# Altium schematic sheet Mini_STM32F405RGT6_V1.0.SchDoc
size A3
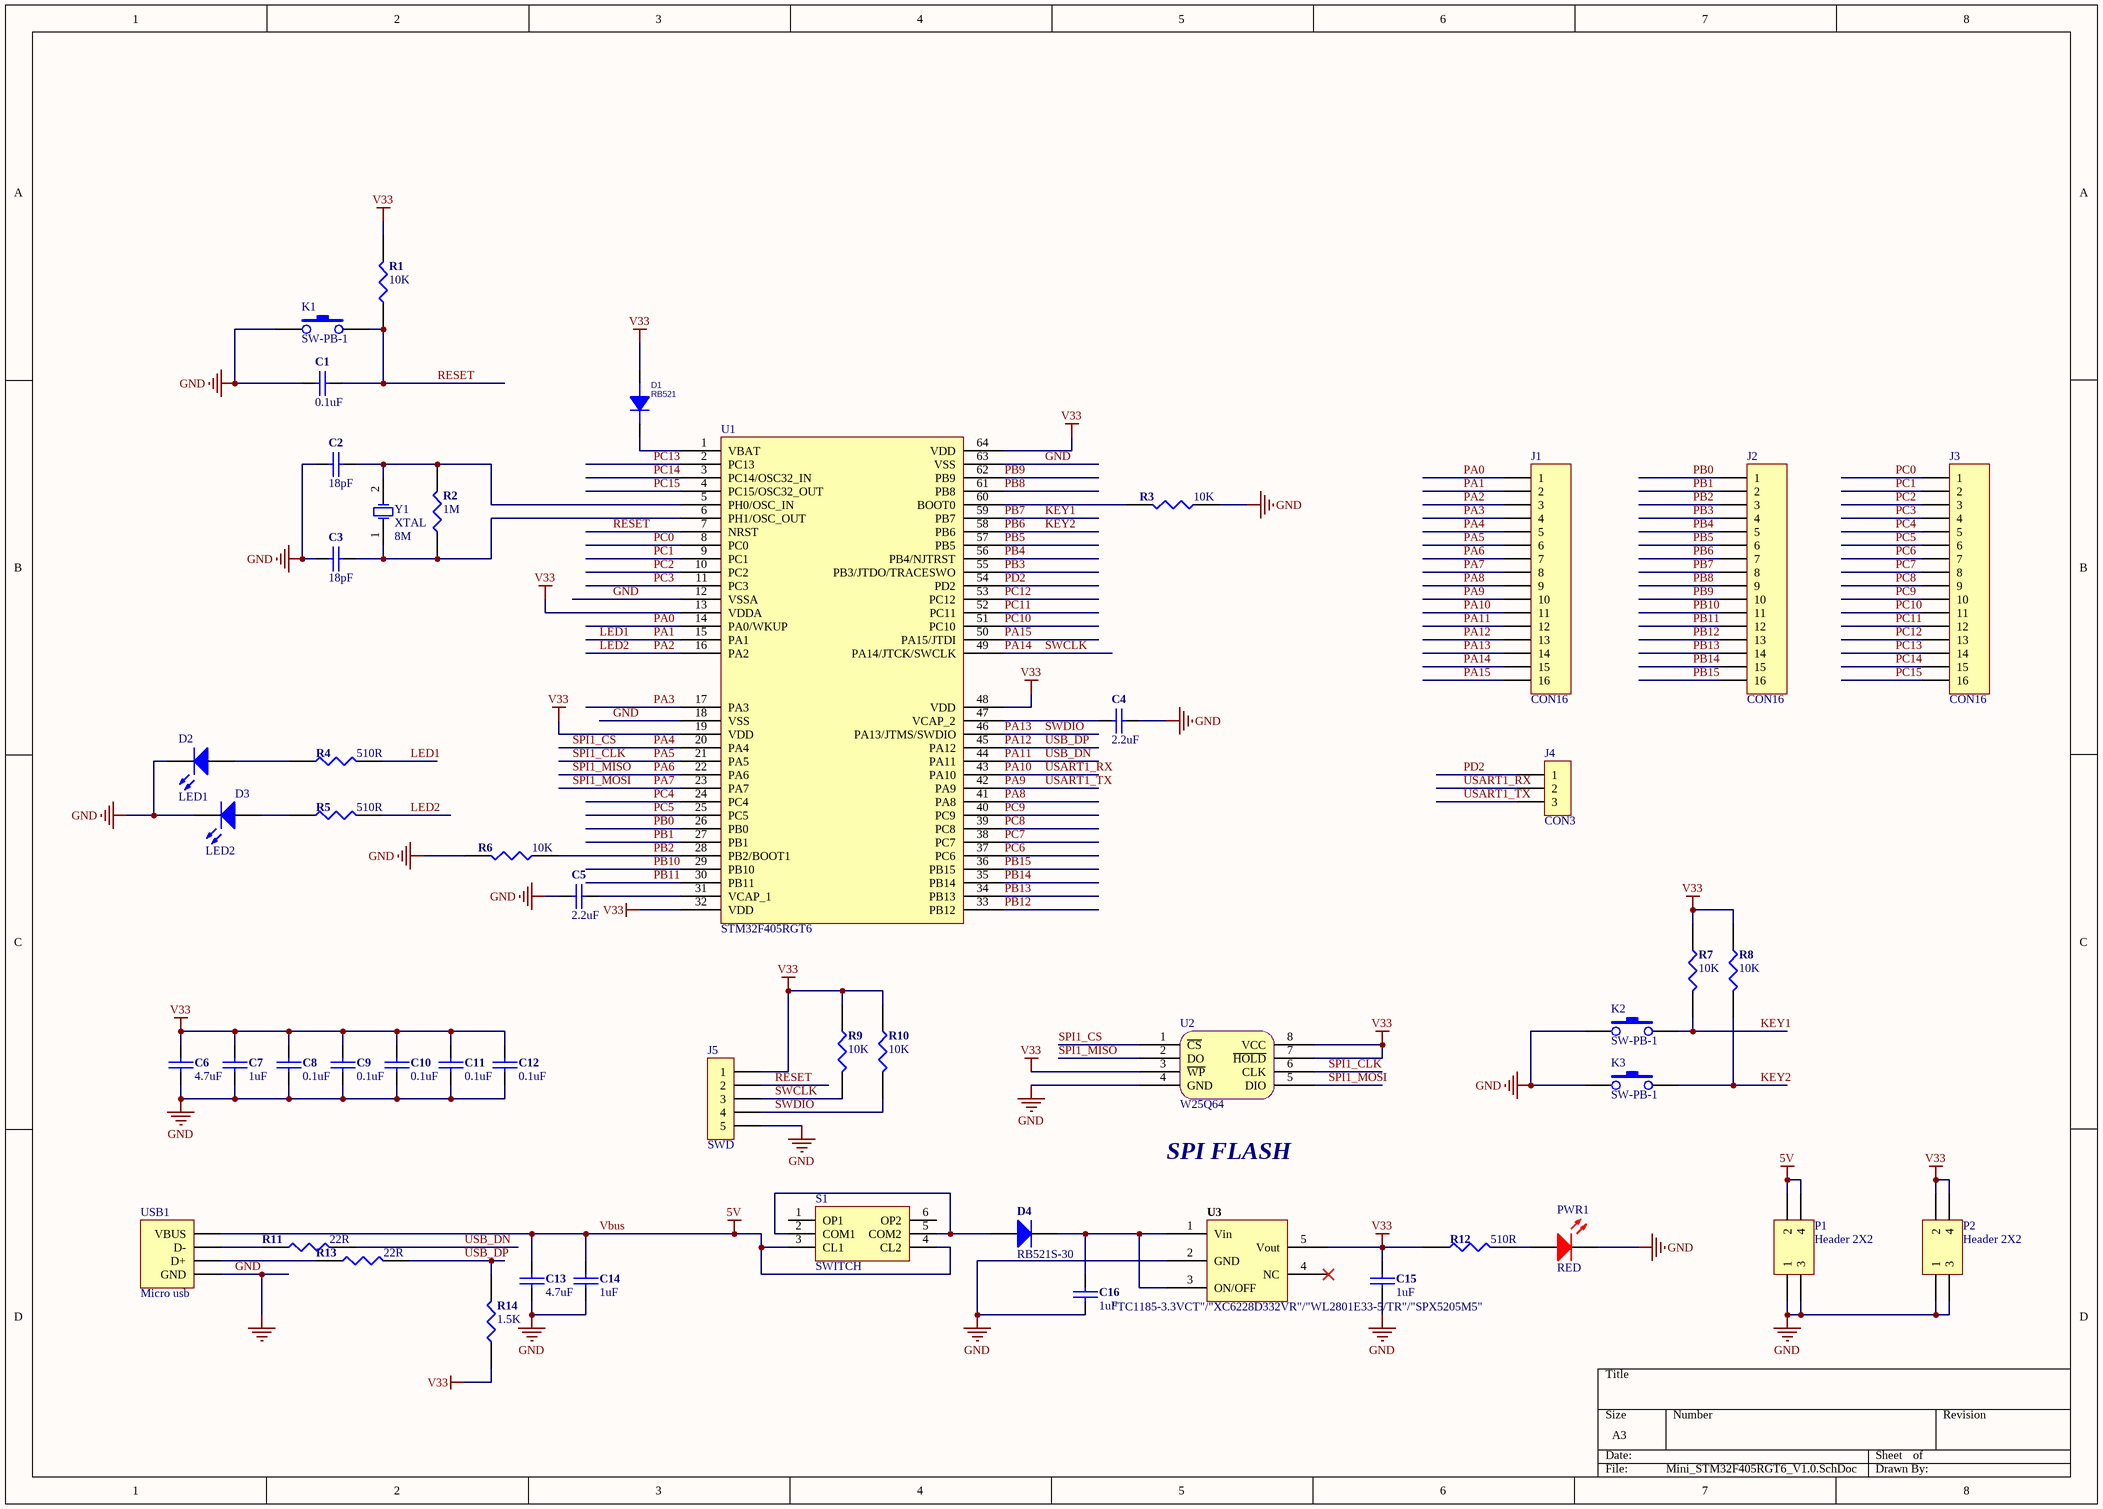
[diagram p0: Mini_STM32F405RGT6_V1.0.SchDoc]

## Parts
C1  0.1uF  [C0402]
C2  18pF  [C0402]
C3  18pF  [C0402]
C4  2.2uF  [C0402]
C5  2.2uF  [C0402]
C6  4.7uF  [C0603]
C7  1uF  [C0402]
C8  0.1uF  [C0402]
C9  0.1uF  [C0402]
C10  0.1uF  [C0402]
C11  0.1uF  [C0402]
C12  0.1uF  [C0402]
C13  4.7uF  [C0603]
C14  1uF  [C0402]
C15  1uF  [C0402]
C16  1uF  [C0402]
D1  RB521  [Diode-0603]
D2  LED1  [LED0603-green]
D3  LED2  [LED0603-green]
D4  RB521S-30  [Diode-0603]
J1  CON16  [HEADER-16]
J2  CON16  [HEADER-16]
J3  CON16  [HEADER-16]
J4  CON3  [HEADER-3]
J5  SWD  [HEADER-5]
K1  SW-PB-1  [SW-4PIN-DIP]
K2  SW-PB-1  [SW-4PIN-DIP]
K3  SW-PB-1  [SW-4PIN-DIP]
P1  Header 2X2  [HDR2X2]
P2  Header 2X2  [HDR2X2]
PWR1  RED  [LED-0805-R]
R1  10K  [R0402 -1]
R2  1M  [R0402 -1]
R3  10K  [R0402 -1]
R4  510R  [R0402 -1]
R5  510R  [R0402 -1]
R6  10K  [R0402 -1]
R7  10K  [R0402 -1]
R8  10K  [R0402 -1]
R9  10K  [R0402 -1]
R10  10K  [R0402 -1]
R11  22R  [R0402 -1]
R12  510R  [R0402 -1]
R13  22R  [R0402 -1]
R14  1.5K  [R0402 -1]
S1  SWITCH  [SWITCH_DDSZ]
U1  STM32F405RGT6  [LQFP-64]
U2  W25Q64  USAGE: SPI FLASH  [SOIC-AB]
U3  "TC1185-3.3VCT"/"XC6228D332VR"/"WL2801E33-5/TR"/"SPX5205M5"  [SOT-23-5]
USB1  Micro usb  [MICRO_USB_9]
Y1  XTAL  [XTAL]

## Nets
4: USB1.5 USB1.6
GND: C1.2 C2.2 C3.2 C4.1 C5.2 C6.1 C7.1 C8.1 C9.1 C10.1 C11.1 C12.1 C13.1 C14.1 C15.1 C16.1 D2.2(K) D3.2(K) J5.5 K1.1 K2.1 K3.1 P1.1 P1.3 P2.1 P2.3 PWR1.2(K) R3.1 R6.2 U1.12(VSSA) U1.18(VSS) U1.63(VSS) U2.4(GND) U3.2(GND) USB1.4(GND)
V33: C6.2 C7.2 C8.2 C9.2 C10.2 C11.2 C12.2 C15.2 D1.1(A) J5.1 P2.2 P2.4 R1.2 R7.1 R8.1 R9.1 R10.1 R12.1 R14.1 U1.13(VDDA) U1.19(VDD) U1.32(VDD) U1.48(VDD) U1.64(VDD) U2.3(~{WP}) U2.7(~{HOLD}) U2.8(VCC) U3.5(Vout)
Vbus: C13.2 C14.2 P1.2 P1.4 S1.3(CL1) S1.4(CL2) USB1.1(VBUS)  [also labelled 5V]
KEY1: J2.8 K2.2 R7.2 U1.59(PB7)  [also labelled PB7]
KEY2: J2.7 K3.2 R8.2 U1.58(PB6)  [also labelled PB6]
LED1: J1.2 R4.2 U1.15(PA1)  [also labelled PA1]
LED2: J1.3 R5.2 U1.16(PA2)  [also labelled PA2]
PA0: J1.1 U1.14(PA0/WKUP)
PA3: J1.4 U1.17(PA3)
PA4: J1.5 U1.20(PA4) U2.1(~{CS})  [also labelled SPI1_CS]
PA5: J1.6 U1.21(PA5) U2.6(CLK)  [also labelled SPI1_CLK]
PA6: J1.7 U1.22(PA6) U2.2(DO)  [also labelled SPI1_MISO]
PA7: J1.8 U1.23(PA7) U2.5(DIO)  [also labelled SPI1_MOSI]
PA8: J1.9 U1.41(PA8)
PA9: J1.10 J4.3 U1.42(PA9)  [also labelled USART1_TX]
PA10: J1.11 J4.2 U1.43(PA10)  [also labelled USART1_RX]
PA11: J1.12 R11.2 U1.44(PA11)  [also labelled USB_DN]
PA12: J1.13 R13.2 R14.2 U1.45(PA12)  [also labelled USB_DP]
PA13: J1.14 J5.4 R10.2 U1.46(PA13/JTMS/SWDIO)  [also labelled SWDIO]
PA14: J1.15 J5.3 R9.2 U1.49(PA14/JTCK/SWCLK)  [also labelled SWCLK]
PA15: J1.16 U1.50(PA15/JTDI)
PB0: J2.1 U1.26(PB0)
PB1: J2.2 U1.27(PB1)
PB2: J2.3 R6.1 U1.28(PB2/BOOT1)
PB3: J2.4 U1.55(PB3/JTDO/TRACESWO)
PB4: J2.5 U1.56(PB4/NJTRST)
PB5: J2.6 U1.57(PB5)
PB8: J2.9 U1.61(PB8)
PB9: J2.10 U1.62(PB9)
PB10: J2.11 U1.29(PB10)
PB11: J2.12 U1.30(PB11)
PB12: J2.13 U1.33(PB12)
PB13: J2.14 U1.34(PB13)
PB14: J2.15 U1.35(PB14)
PB15: J2.16 U1.36(PB15)
PC0: J3.1 U1.8(PC0)
PC1: J3.2 U1.9(PC1)
PC2: J3.3 U1.10(PC2)
PC3: J3.4 U1.11(PC3)
PC4: J3.5 U1.24(PC4)
PC5: J3.6 U1.25(PC5)
PC6: J3.7 U1.37(PC6)
PC7: J3.8 U1.38(PC7)
PC8: J3.9 U1.39(PC8)
PC9: J3.10 U1.40(PC9)
PC10: J3.11 U1.51(PC10)
PC11: J3.12 U1.52(PC11)
PC12: J3.13 U1.53(PC12)
PC13: J3.14 U1.2(PC13)
PC14: J3.15 U1.3(PC14/OSC32_IN)
PC15: J3.16 U1.4(PC15/OSC32_OUT)
PD2: J4.1 U1.54(PD2)
RESET: C1.1 J5.2 K1.2 R1.1 U1.7(NRST)
NetC2_1: C2.1 R2.2 U1.5(PH0/OSC_IN) Y1.2(OSC2)
NetC3_1: C3.1 R2.1 U1.6(PH1/OSC_OUT) Y1.1(OSC1)
NetC4_2: C4.2 U1.47(VCAP_2)
NetC5_1: C5.1 U1.31(VCAP_1)
NetC16_2: C16.2 D4.2(K) U3.1(Vin) U3.3(ON/OFF)
NetD1_2: D1.2(K) U1.1(VBAT)
NetD2_1: D2.1(A) R4.1
NetD3_1: D3.1(A) R5.1
NetD4_1: D4.1(A) S1.2(COM1) S1.5(COM2)
NetPWR1_1: PWR1.1(A) R12.2
NetR3_2: R3.2 U1.60(BOOT0)
NetR11_1: R11.1 USB1.2(D-)
NetR13_1: R13.1 USB1.3(D+)

Not connected (* = marked no-connect by the designer): S1 1(OP1) 6(OP2); U3 4(NC)*

## Notes on the sheet
- (in symbol XTAL) 8M

## Library data of the parts
C1-C12 = CAP: SMT电容; Precision: 6.3V耐压; LIB: SMT电容
C13 = CAP: SMT电容; Precision: 16V耐压; LIB: SMT电容
C14-C16 = 电容: Precision: 6.3V耐压; LIB: SMT电容
D1 = DIODE
D2 D3 = LED0: Typical INFRARED GaAs LED; Published: 8-Jun-2000; LatestRevisionDate: 08-Jul-2005; LatestRevisionNote: Mech Layer 1 removed.; PackageReference: LED-0; Publisher: Altium Limited; PackageDescription: LED; 2 Leads
D4 = Diode 1N914: 二极管; Published: 8-Jun-2000; LatestRevisionDate: 17-Jul-2002; LatestRevisionNote: Re-released for DXP Platform.; DatasheetDocument: 1997; PackageReference: DO-35; Publisher: Altium Limited; Code_JEDEC: DO-204-AH; ComponentLink1Description: Manufacturer Link; ComponentLink1URL: http://www.fairchildsemi.com/; ComponentLink2Description: Datasheet; ComponentLink2URL: http://www.fairchildsemi.com/ds/1N%2F1N4448.pdf
J1-J3 = CON16: Connector
J4 = CON3: Connector
J5 = CON5: Connector
K1-K3 = SW-PB-1: 轻触按键
P1 P2 = Header 2X2: Header, 2-Pin, Dual row; LatestRevisionDate: 17-Jul-2002; LatestRevisionNote: Re-released for DXP Platform.; Publisher: Altium Limited
PWR1 = LED1
R1-R14 = RES1: SMT电阻; Precision: 5% 精度; LIB: SMT 电阻
U2 = W25X40: nor flash
U3 = S1132: LDO
USB1 = USB joggle
Y1 = XTAL: Crystal Oscillator; Published: 8-Jun-2000; LatestRevisionDate: 17-Jul-2002; LatestRevisionNote: Re-released for DXP Platform.; Publisher: Altium Limited